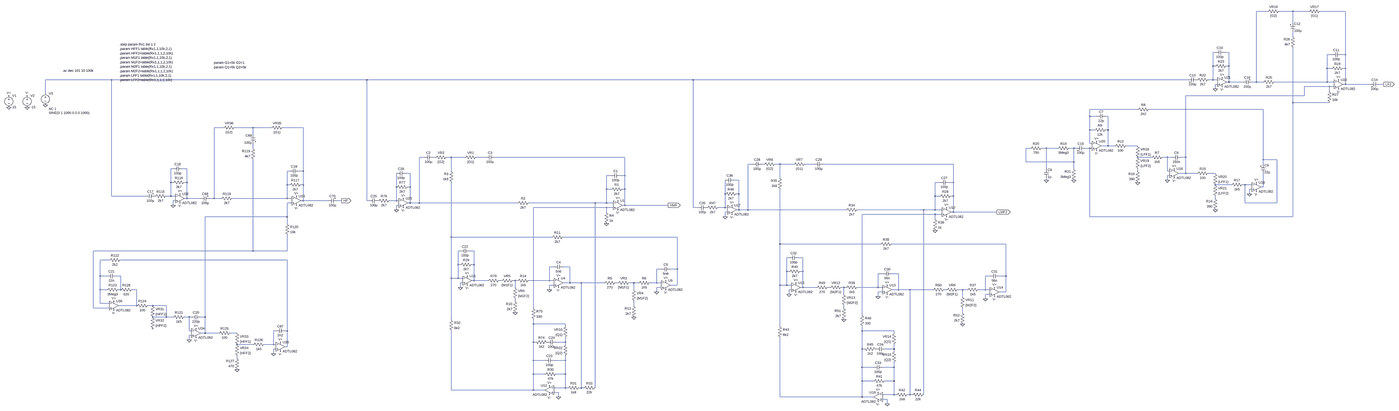
[diagram p0: schematic purrtico_m.asc, whole sheet]
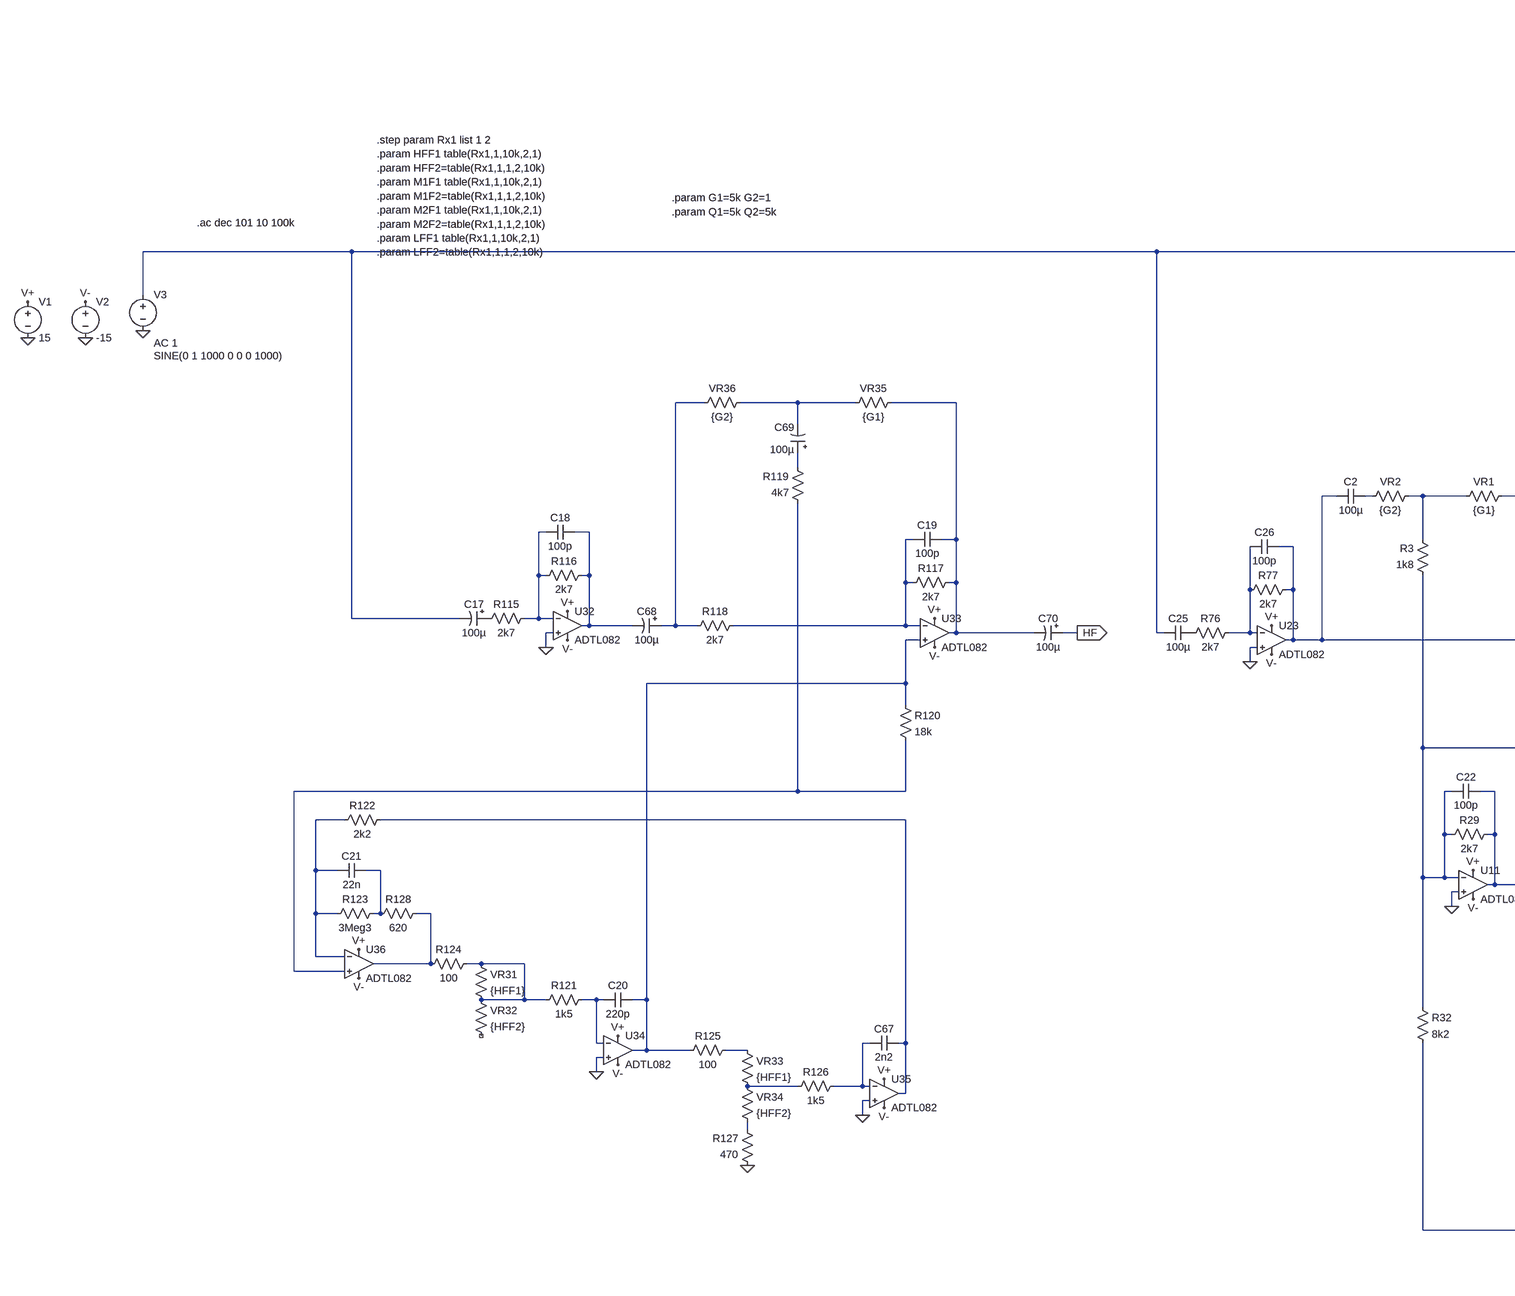
[diagram p1: schematic purrtico_m.asc, part, row 1 of 1, column 1 of 3]
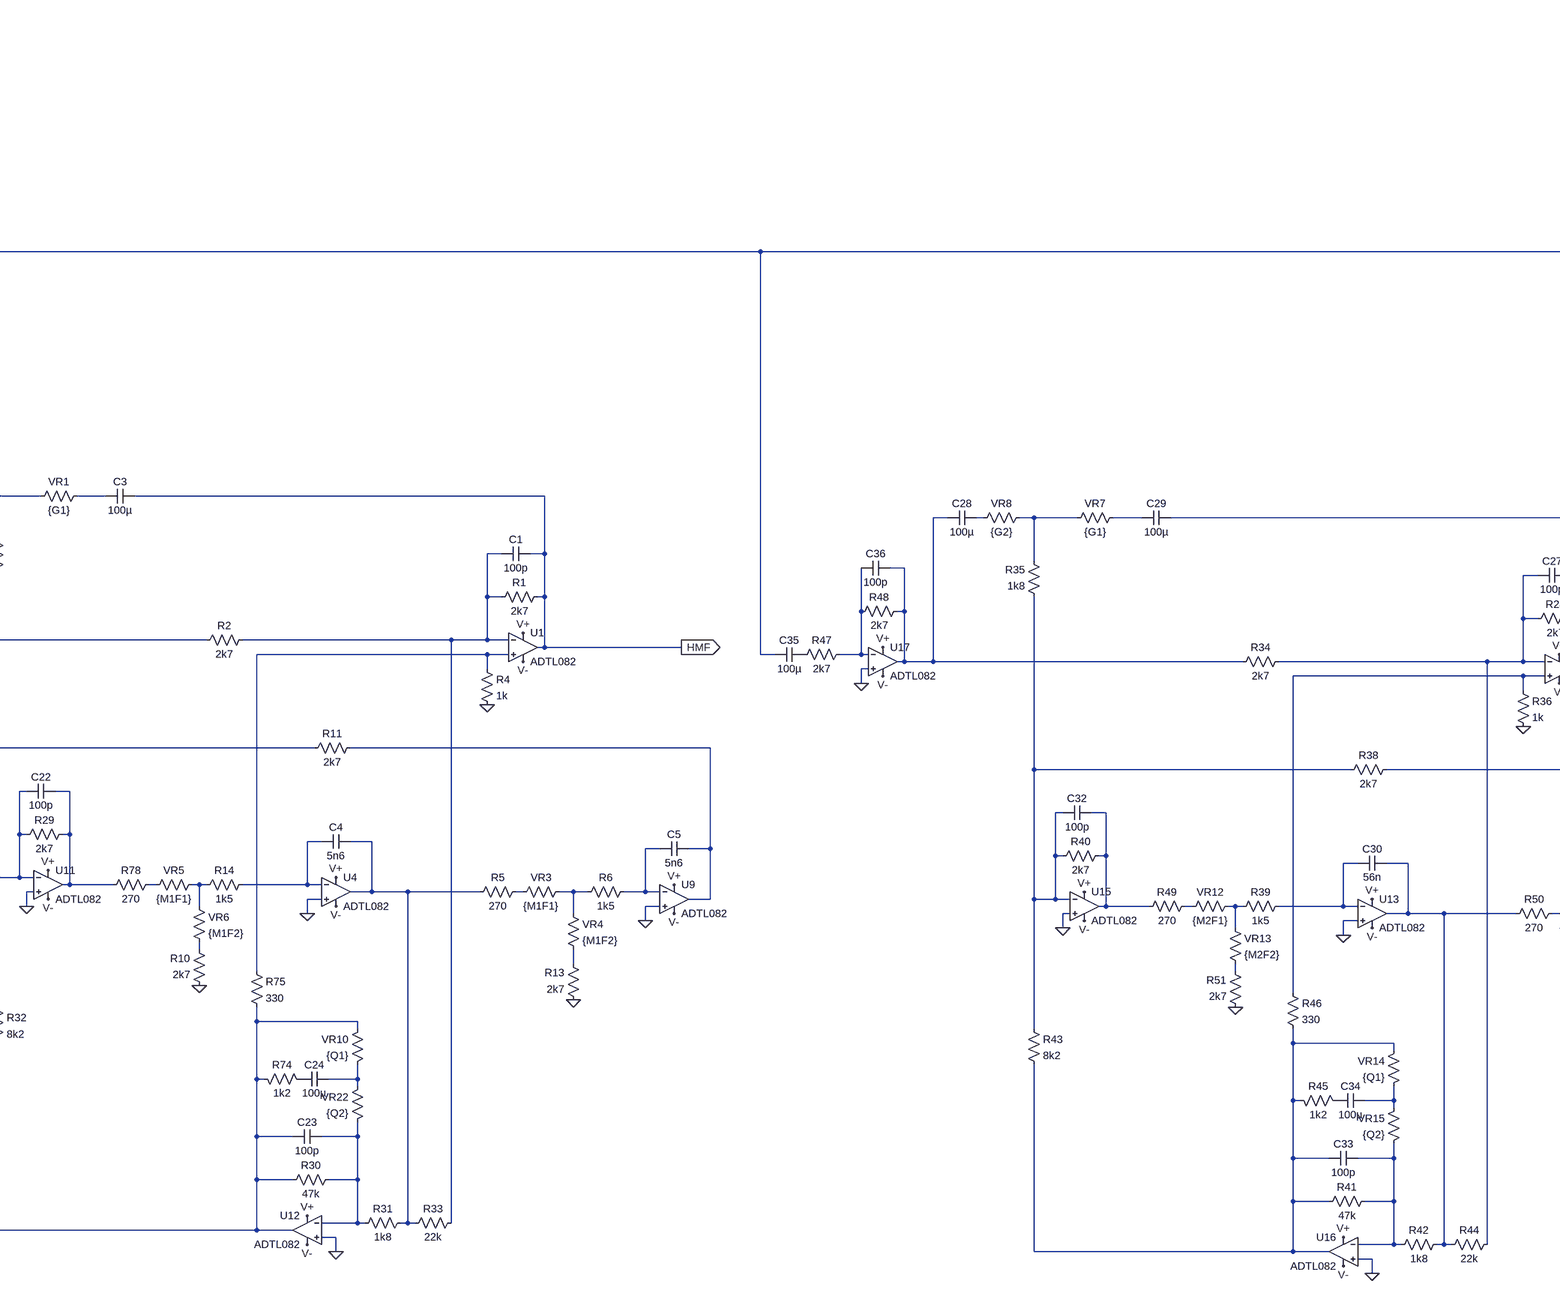
[diagram p2: schematic purrtico_m.asc, part, row 1 of 1, column 2 of 3]
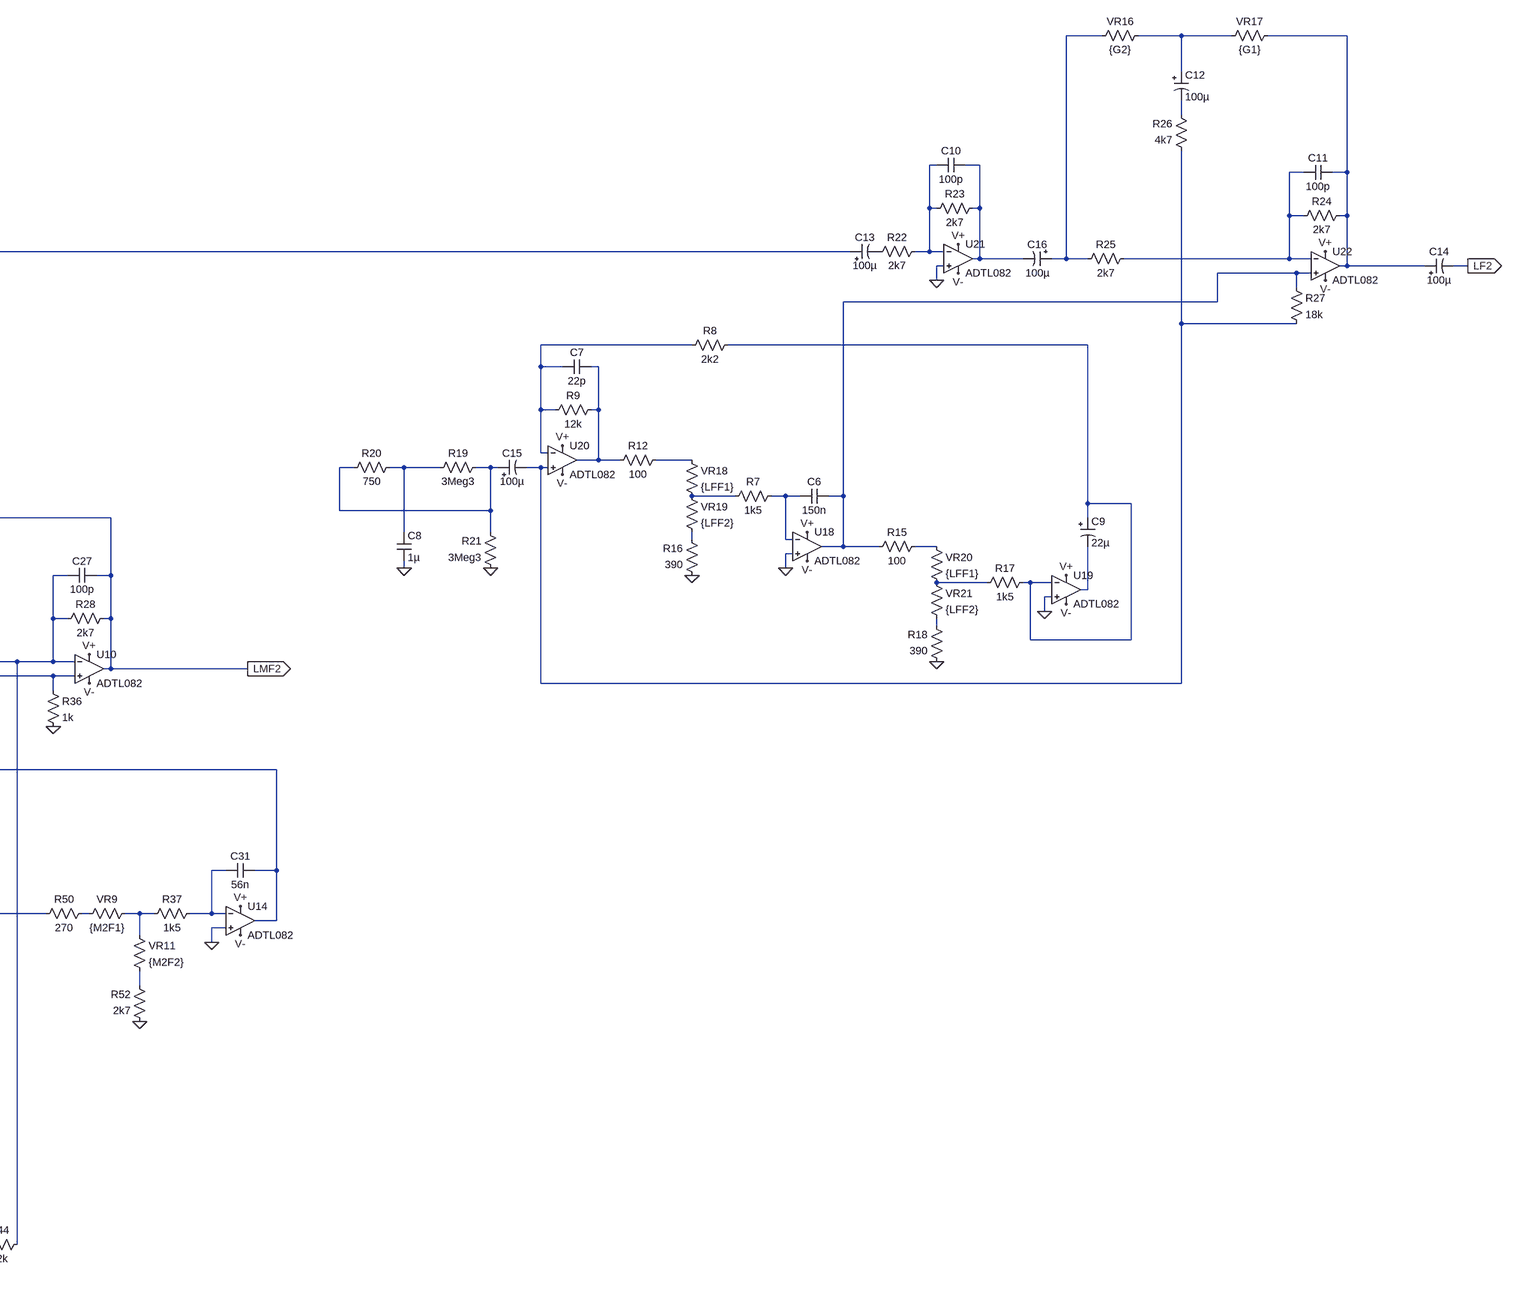
[diagram p3: schematic purrtico_m.asc, part, row 1 of 1, column 3 of 3]
purrtico_m.asc, the LTspice schematic file:
Version 4
SHEET 1 4100 3784
WIRE 960 -736 880 -736
WIRE 1136 -736 1040 -736
WIRE 1248 -736 1136 -736
WIRE 1504 -736 1328 -736
WIRE 1136 -656 1136 -736
WIRE 1136 -560 1136 -592
WIRE 592 -448 576 -448
WIRE 688 -448 656 -448
WIRE 1408 -432 1376 -432
WIRE 1504 -432 1504 -736
WIRE 1504 -432 1472 -432
WIRE 576 -352 576 -448
WIRE 592 -352 576 -352
WIRE 688 -352 688 -448
WIRE 688 -352 672 -352
WIRE 1376 -336 1376 -432
WIRE 1408 -336 1376 -336
WIRE 1504 -336 1504 -432
WIRE 1504 -336 1488 -336
WIRE -7264 -256 -7728 -256
WIRE -5376 -256 -7264 -256
WIRE -3088 -256 -5376 -256
WIRE 400 -256 -3088 -256
WIRE 576 -256 576 -352
WIRE 576 -256 544 -256
WIRE 608 -256 576 -256
WIRE 688 -240 688 -352
WIRE 688 -240 672 -240
WIRE 784 -240 688 -240
WIRE 880 -240 880 -736
WIRE 880 -240 848 -240
WIRE 928 -240 880 -240
WIRE 1376 -240 1376 -336
WIRE 1376 -240 1008 -240
WIRE 1424 -240 1376 -240
WIRE 608 -224 592 -224
WIRE 1504 -224 1504 -336
WIRE 1504 -224 1488 -224
WIRE 1712 -224 1504 -224
WIRE 1808 -224 1776 -224
WIRE 1392 -208 1216 -208
WIRE 1424 -208 1392 -208
WIRE 592 -192 592 -224
WIRE 1392 -176 1392 -208
WIRE -7728 -160 -7728 -256
WIRE 1216 -144 1216 -208
WIRE 1216 -144 384 -144
WIRE 1136 -96 1136 -480
WIRE 1392 -96 1136 -96
WIRE 48 -48 -288 -48
WIRE 928 -48 128 -48
WIRE -288 0 -288 -48
WIRE -240 0 -288 0
WIRE -160 0 -176 0
WIRE -6480 80 -6544 80
WIRE -6272 80 -6400 80
WIRE -6144 80 -6272 80
WIRE -5920 80 -6064 80
WIRE -288 96 -288 0
WIRE -256 96 -288 96
WIRE -160 96 -160 0
WIRE -160 96 -176 96
WIRE -6272 128 -6272 80
WIRE -288 192 -288 96
WIRE -272 192 -288 192
WIRE -160 208 -160 96
WIRE -160 208 -208 208
WIRE -112 208 -160 208
WIRE 48 208 -32 208
WIRE -6272 224 -6272 192
WIRE -704 224 -736 224
WIRE -592 224 -624 224
WIRE -512 224 -592 224
WIRE -400 224 -432 224
WIRE -384 224 -400 224
WIRE -288 224 -320 224
WIRE -272 224 -288 224
WIRE -4976 288 -5008 288
WIRE -4896 288 -4912 288
WIRE -4784 288 -4816 288
WIRE -4688 288 -4784 288
WIRE -4544 288 -4608 288
WIRE -3568 288 -4480 288
WIRE 144 288 48 288
WIRE 256 288 224 288
WIRE 288 288 256 288
WIRE 384 288 384 -144
WIRE 384 288 352 288
WIRE 928 304 928 -48
WIRE 1024 304 928 304
WIRE -736 320 -736 224
WIRE -400 320 -400 224
WIRE -400 320 -736 320
WIRE -2672 336 -2704 336
WIRE -2592 336 -2608 336
WIRE -2480 336 -2512 336
WIRE -2384 336 -2480 336
WIRE -2240 336 -2304 336
WIRE -1264 336 -2176 336
WIRE 928 336 928 304
WIRE -6832 368 -6848 368
WIRE -6736 368 -6768 368
WIRE -592 368 -592 224
WIRE -400 368 -400 320
WIRE -6016 384 -6032 384
WIRE -5920 384 -5920 80
WIRE -5920 384 -5952 384
WIRE -4784 384 -4784 288
WIRE 48 384 48 368
WIRE 256 384 256 288
WIRE 272 384 256 384
WIRE -5072 400 -5104 400
WIRE 384 400 384 288
WIRE 384 400 336 400
WIRE 464 400 384 400
WIRE 592 400 544 400
WIRE -3664 416 -3696 416
WIRE -3568 416 -3568 288
WIRE -3568 416 -3600 416
WIRE 272 416 256 416
WIRE -2480 432 -2480 336
WIRE -2768 448 -2800 448
WIRE -592 448 -592 432
WIRE 256 448 256 416
WIRE -6848 464 -6848 368
WIRE -6832 464 -6848 464
WIRE -6736 464 -6736 368
WIRE -6736 464 -6752 464
WIRE -1360 464 -1392 464
WIRE -1264 464 -1264 336
WIRE -1264 464 -1296 464
WIRE -6032 480 -6032 384
WIRE -6016 480 -6032 480
WIRE -5920 480 -5920 384
WIRE -5920 480 -5936 480
WIRE 704 480 592 480
WIRE 800 480 784 480
WIRE 848 480 800 480
WIRE -5168 496 -5168 400
WIRE -5072 496 -5072 400
WIRE -5072 496 -5088 496
WIRE 928 496 928 400
WIRE 928 496 912 496
WIRE -3696 512 -3696 416
WIRE -3664 512 -3696 512
WIRE -3568 512 -3568 416
WIRE -3568 512 -3584 512
WIRE 848 512 832 512
WIRE -2864 544 -2864 448
WIRE -2768 544 -2768 448
WIRE -2768 544 -2784 544
WIRE 832 544 832 512
WIRE -7264 560 -7264 -256
WIRE -7024 560 -7264 560
WIRE -6848 560 -6848 464
WIRE -6848 560 -6880 560
WIRE -6816 560 -6848 560
WIRE -1392 560 -1392 464
WIRE -1360 560 -1392 560
WIRE -1264 560 -1264 464
WIRE -1264 560 -1280 560
WIRE -6736 576 -6736 464
WIRE -6736 576 -6752 576
WIRE -6640 576 -6736 576
WIRE -6544 576 -6544 80
WIRE -6544 576 -6576 576
WIRE -6496 576 -6544 576
WIRE -6032 576 -6032 480
WIRE -6032 576 -6416 576
WIRE -6000 576 -6032 576
WIRE 592 576 592 560
WIRE -6816 592 -6832 592
WIRE -5920 592 -5920 480
WIRE -5920 592 -5936 592
WIRE -5712 592 -5920 592
WIRE -5616 592 -5648 592
WIRE -5376 592 -5376 -256
WIRE -5360 592 -5376 592
WIRE -5168 592 -5168 496
WIRE -5168 592 -5216 592
WIRE -5152 592 -5168 592
WIRE -6000 608 -6032 608
WIRE -5072 608 -5072 496
WIRE -5072 608 -5088 608
WIRE -5008 608 -5008 288
WIRE -5008 608 -5072 608
WIRE -4320 608 -5008 608
WIRE -3776 608 -4240 608
WIRE -3696 608 -3696 512
WIRE -3696 608 -3776 608
WIRE -3648 608 -3696 608
WIRE 800 608 800 480
WIRE 1024 608 1024 304
WIRE 1024 608 800 608
WIRE -6832 624 -6832 592
WIRE -5152 624 -5168 624
WIRE -3568 624 -3568 512
WIRE -3568 624 -3584 624
WIRE -3264 624 -3568 624
WIRE -3696 640 -4208 640
WIRE -3648 640 -3696 640
WIRE -3088 640 -3088 -256
WIRE -3056 640 -3088 640
WIRE -2864 640 -2864 544
WIRE -2864 640 -2912 640
WIRE -2848 640 -2864 640
WIRE -5168 656 -5168 624
WIRE -2768 656 -2768 544
WIRE -2768 656 -2784 656
WIRE -2704 656 -2704 336
WIRE -2704 656 -2768 656
WIRE -2016 656 -2704 656
WIRE -1472 656 -1936 656
WIRE -1392 656 -1392 560
WIRE -1392 656 -1472 656
WIRE -1344 656 -1392 656
WIRE -3696 672 -3696 640
WIRE -2848 672 -2864 672
WIRE -1264 672 -1264 560
WIRE -1264 672 -1280 672
WIRE -960 672 -1264 672
WIRE -1392 688 -1904 688
WIRE -1344 688 -1392 688
WIRE -6032 704 -6032 608
WIRE -6032 704 -6608 704
WIRE -2864 704 -2864 672
WIRE -288 704 -288 224
WIRE 1136 704 1136 -96
WIRE 1136 704 -288 704
WIRE -1392 720 -1392 688
WIRE -6032 752 -6032 704
WIRE -4784 848 -4784 464
WIRE -4080 848 -4784 848
WIRE -3200 848 -4000 848
WIRE -2480 896 -2480 512
WIRE -1776 896 -2480 896
WIRE -896 896 -1696 896
WIRE -6272 944 -6272 304
WIRE -6272 944 -7392 944
WIRE -6032 944 -6032 832
WIRE -6032 944 -6272 944
WIRE -4720 944 -4736 944
WIRE -4624 944 -4656 944
WIRE -2416 992 -2432 992
WIRE -2320 992 -2352 992
WIRE -7280 1008 -7344 1008
WIRE -6032 1008 -7200 1008
WIRE -4736 1040 -4736 944
WIRE -4720 1040 -4736 1040
WIRE -4624 1040 -4624 944
WIRE -4624 1040 -4640 1040
WIRE -4064 1056 -4096 1056
WIRE -3952 1056 -4000 1056
WIRE -3312 1072 -3344 1072
WIRE -3200 1072 -3200 848
WIRE -3200 1072 -3248 1072
WIRE -2432 1088 -2432 992
WIRE -2416 1088 -2432 1088
WIRE -2320 1088 -2320 992
WIRE -2320 1088 -2336 1088
WIRE -1760 1104 -1792 1104
WIRE -1648 1104 -1696 1104
WIRE -7344 1120 -7344 1008
WIRE -7296 1120 -7344 1120
WIRE -7200 1120 -7232 1120
WIRE -1008 1120 -1040 1120
WIRE -896 1120 -896 896
WIRE -896 1120 -944 1120
WIRE -4784 1136 -4784 848
WIRE -4736 1136 -4736 1040
WIRE -4736 1136 -4784 1136
WIRE -4704 1136 -4736 1136
WIRE -4624 1152 -4624 1040
WIRE -4624 1152 -4640 1152
WIRE -4528 1152 -4624 1152
WIRE -4432 1152 -4448 1152
WIRE -4336 1152 -4352 1152
WIRE -4320 1152 -4336 1152
WIRE -4096 1152 -4096 1056
WIRE -4096 1152 -4240 1152
WIRE -4064 1152 -4096 1152
WIRE -4704 1168 -4720 1168
WIRE -3952 1168 -3952 1056
WIRE -3952 1168 -4000 1168
WIRE -3872 1168 -3952 1168
WIRE -3712 1168 -3872 1168
WIRE -3616 1168 -3632 1168
WIRE -3504 1168 -3536 1168
WIRE -3472 1168 -3504 1168
WIRE -3344 1168 -3344 1072
WIRE -3344 1168 -3392 1168
WIRE -3312 1168 -3344 1168
WIRE -4064 1184 -4096 1184
WIRE -3200 1184 -3200 1072
WIRE -3200 1184 -3248 1184
WIRE -2480 1184 -2480 896
WIRE -2432 1184 -2432 1088
WIRE -2432 1184 -2480 1184
WIRE -2400 1184 -2432 1184
WIRE -4720 1200 -4720 1168
WIRE -4336 1200 -4336 1152
WIRE -3312 1200 -3344 1200
WIRE -2320 1200 -2320 1088
WIRE -2320 1200 -2336 1200
WIRE -2224 1200 -2320 1200
WIRE -2128 1200 -2144 1200
WIRE -2032 1200 -2048 1200
WIRE -2016 1200 -2032 1200
WIRE -1792 1200 -1792 1104
WIRE -1792 1200 -1936 1200
WIRE -1760 1200 -1792 1200
WIRE -7344 1216 -7344 1120
WIRE -7296 1216 -7344 1216
WIRE -7200 1216 -7200 1120
WIRE -7200 1216 -7216 1216
WIRE -7088 1216 -7120 1216
WIRE -4096 1216 -4096 1184
WIRE -3504 1216 -3504 1168
WIRE -2400 1216 -2416 1216
WIRE -1648 1216 -1648 1104
WIRE -1648 1216 -1696 1216
WIRE -1568 1216 -1648 1216
WIRE -1408 1216 -1568 1216
WIRE -1312 1216 -1328 1216
WIRE -1200 1216 -1232 1216
WIRE -1168 1216 -1200 1216
WIRE -1040 1216 -1040 1120
WIRE -1040 1216 -1088 1216
WIRE -1008 1216 -1040 1216
WIRE -3344 1232 -3344 1200
WIRE -1760 1232 -1792 1232
WIRE -896 1232 -896 1120
WIRE -896 1232 -944 1232
WIRE -2416 1248 -2416 1216
WIRE -2032 1248 -2032 1200
WIRE -1008 1248 -1040 1248
WIRE -1792 1264 -1792 1232
WIRE -1200 1264 -1200 1216
WIRE -1040 1280 -1040 1248
WIRE -4336 1296 -4336 1280
WIRE -7344 1312 -7344 1216
WIRE -7280 1312 -7344 1312
WIRE -7088 1328 -7088 1216
WIRE -7088 1328 -7216 1328
WIRE -6976 1328 -7008 1328
WIRE -6880 1328 -6976 1328
WIRE -3504 1328 -3504 1296
WIRE -7392 1344 -7392 944
WIRE -7280 1344 -7392 1344
WIRE -4208 1344 -4208 640
WIRE -2032 1344 -2032 1328
WIRE -1200 1376 -1200 1344
WIRE -1904 1392 -1904 688
WIRE -6880 1408 -6880 1328
WIRE -6880 1408 -6976 1408
WIRE -6832 1408 -6880 1408
WIRE -6720 1408 -6752 1408
WIRE -6704 1408 -6720 1408
WIRE -6608 1408 -6608 704
WIRE -6608 1408 -6640 1408
WIRE -4784 1424 -4784 1136
WIRE -4208 1456 -4208 1424
WIRE -3984 1456 -4208 1456
WIRE -3984 1472 -3984 1456
WIRE -2480 1472 -2480 1184
WIRE -6720 1504 -6720 1408
WIRE -6704 1504 -6720 1504
WIRE -6112 1504 -6128 1504
WIRE -6032 1504 -6032 1008
WIRE -6032 1504 -6048 1504
WIRE -1904 1504 -1904 1472
WIRE -1680 1504 -1904 1504
WIRE -6608 1520 -6608 1408
WIRE -6608 1520 -6640 1520
WIRE -6512 1520 -6608 1520
WIRE -6384 1520 -6432 1520
WIRE -1680 1520 -1680 1504
WIRE -6704 1536 -6720 1536
WIRE -6720 1568 -6720 1536
WIRE -4208 1584 -4208 1456
WIRE -4192 1584 -4208 1584
WIRE -3984 1584 -3984 1552
WIRE -3984 1584 -4048 1584
WIRE -6272 1600 -6384 1600
WIRE -6128 1600 -6128 1504
WIRE -6128 1600 -6192 1600
WIRE -6112 1600 -6128 1600
WIRE -3984 1600 -3984 1584
WIRE -6032 1616 -6032 1504
WIRE -6032 1616 -6048 1616
WIRE -6112 1632 -6128 1632
WIRE -1904 1632 -1904 1504
WIRE -1888 1632 -1904 1632
WIRE -1680 1632 -1680 1600
WIRE -1680 1632 -1744 1632
WIRE -1680 1648 -1680 1632
WIRE -6128 1664 -6128 1632
WIRE -6384 1696 -6384 1680
WIRE -4208 1712 -4208 1584
WIRE -4128 1712 -4208 1712
WIRE -3984 1712 -3984 1680
WIRE -3984 1712 -4064 1712
WIRE -1904 1760 -1904 1632
WIRE -1824 1760 -1904 1760
WIRE -1680 1760 -1680 1728
WIRE -1680 1760 -1760 1760
WIRE -4208 1808 -4208 1712
WIRE -4128 1808 -4208 1808
WIRE -3984 1808 -3984 1712
WIRE -3984 1808 -4048 1808
WIRE -1904 1856 -1904 1760
WIRE -1824 1856 -1904 1856
WIRE -1680 1856 -1680 1760
WIRE -1680 1856 -1744 1856
WIRE -3984 1904 -3984 1808
WIRE -3984 1904 -4064 1904
WIRE -3968 1904 -3984 1904
WIRE -3872 1904 -3872 1168
WIRE -3872 1904 -3888 1904
WIRE -3856 1904 -3872 1904
WIRE -3776 1904 -3776 608
WIRE -4784 1920 -4784 1504
WIRE -4208 1920 -4208 1808
WIRE -4208 1920 -4784 1920
WIRE -4128 1920 -4208 1920
WIRE -4032 1936 -4064 1936
WIRE -1680 1952 -1680 1856
WIRE -1680 1952 -1760 1952
WIRE -1664 1952 -1680 1952
WIRE -1568 1952 -1568 1216
WIRE -1568 1952 -1584 1952
WIRE -1552 1952 -1568 1952
WIRE -1472 1952 -1472 656
WIRE -4032 1968 -4032 1936
WIRE -2480 1968 -2480 1552
WIRE -1904 1968 -1904 1856
WIRE -1904 1968 -2480 1968
WIRE -1824 1968 -1904 1968
WIRE -1728 1984 -1760 1984
WIRE -1728 2016 -1728 1984
FLAG -7984 -64 0
FLAG -7984 -144 V+
FLAG -7856 -64 0
FLAG -7856 -144 V-
FLAG -7728 -80 0
FLAG -5616 592 HF
IOPIN -5616 592 Out
FLAG -6784 544 V+
FLAG -6784 608 V-
FLAG -6832 624 0
FLAG -5968 560 V+
FLAG -5968 624 V-
FLAG -6672 1488 V+
FLAG -6672 1552 V-
FLAG -6720 1568 0
FLAG -6080 1584 V+
FLAG -6080 1648 V-
FLAG -7248 1296 V+
FLAG -7248 1360 V-
FLAG -6128 1664 0
FLAG -6384 1776 0
FLAG 304 368 V+
FLAG 304 432 V-
FLAG 256 448 0
FLAG 880 464 V+
FLAG 880 528 V-
FLAG -240 176 V+
FLAG -240 240 V-
FLAG 832 544 0
FLAG 592 656 0
FLAG -592 448 0
FLAG -400 448 0
FLAG 1808 -224 LF2
IOPIN 1808 -224 Out
FLAG 640 -272 V+
FLAG 640 -208 V-
FLAG 592 -192 0
FLAG 1456 -256 V+
FLAG 1456 -192 V-
FLAG 48 464 0
FLAG -3264 624 HMF
IOPIN -3264 624 Out
FLAG -3616 592 V+
FLAG -3616 656 V-
FLAG -3696 752 0
FLAG -4032 1136 V+
FLAG -4032 1200 V-
FLAG -3280 1152 V+
FLAG -3280 1216 V-
FLAG -3344 1232 0
FLAG -4096 1216 0
FLAG -3504 1408 0
FLAG -4672 1120 V+
FLAG -4672 1184 V-
FLAG -4720 1200 0
FLAG -4336 1376 0
FLAG -4096 1888 V+
FLAG -4096 1952 V-
FLAG -4032 1968 0
FLAG -5120 576 V+
FLAG -5120 640 V-
FLAG -5168 656 0
FLAG -960 672 LMF2
IOPIN -960 672 Out
FLAG -1312 640 V+
FLAG -1312 704 V-
FLAG -1392 800 0
FLAG -1728 1184 V+
FLAG -1728 1248 V-
FLAG -976 1200 V+
FLAG -976 1264 V-
FLAG -1040 1280 0
FLAG -1792 1264 0
FLAG -1200 1456 0
FLAG -2368 1168 V+
FLAG -2368 1232 V-
FLAG -2416 1248 0
FLAG -2032 1424 0
FLAG -1792 1936 V+
FLAG -1792 2000 V-
FLAG -1728 2016 0
FLAG -2816 624 V+
FLAG -2816 688 V-
FLAG -2864 704 0
SYMBOL voltage -7984 -160 R0
WINDOW 123 0 0 Left 0
WINDOW 39 0 0 Left 0
SYMATTR InstName V1
SYMATTR Value 15
SYMBOL voltage -7856 -160 R0
WINDOW 123 0 0 Left 0
WINDOW 39 0 0 Left 0
SYMATTR InstName V2
SYMATTR Value -15
SYMBOL voltage -7728 -176 R0
WINDOW 3 24 152 Left 2
WINDOW 123 24 124 Left 2
WINDOW 39 0 0 Left 0
SYMATTR Value SINE(0 1 1000 0 0 0 1000)
SYMATTR Value2 AC 1
SYMATTR InstName V3
SYMBOL polcap -6960 544 R90
WINDOW 0 0 32 VBottom 2
WINDOW 3 32 32 VTop 2
SYMATTR InstName C17
SYMATTR Value 100µ
SYMATTR Description Capacitor
SYMATTR Type cap
SYMATTR SpiceLine V=35 Irms=414m Rser=0.18 Lser=3.3n mfg="Würth Elektronik" pn="860160574013 WCAP-ATLL 8x11,5" type="Al electrolytic"
SYMBOL res -6864 544 R90
WINDOW 0 0 56 VBottom 2
WINDOW 3 32 56 VTop 2
SYMATTR InstName R115
SYMATTR Value 2k7
SYMBOL Opamps\\ADTL082 -6784 512 R0
SYMATTR InstName U32
SYMBOL res -6736 448 R90
WINDOW 0 0 56 VBottom 2
WINDOW 3 32 56 VTop 2
SYMATTR InstName R116
SYMATTR Value 2k7
SYMBOL cap -6768 352 R90
WINDOW 0 0 32 VBottom 2
WINDOW 3 32 32 VTop 2
SYMATTR InstName C18
SYMATTR Value 100p
SYMBOL Opamps\\ADTL082 -5968 528 R0
SYMATTR InstName U33
SYMBOL res -5920 464 R90
WINDOW 0 0 56 VBottom 2
WINDOW 3 32 56 VTop 2
SYMATTR InstName R117
SYMATTR Value 2k7
SYMBOL cap -5952 368 R90
WINDOW 0 0 32 VBottom 2
WINDOW 3 32 32 VTop 2
SYMATTR InstName C19
SYMATTR Value 100p
SYMBOL res -6400 560 R90
WINDOW 0 0 56 VBottom 2
WINDOW 3 32 56 VTop 2
SYMATTR InstName R118
SYMATTR Value 2k7
SYMBOL res -6256 320 R180
WINDOW 0 36 76 Left 2
WINDOW 3 36 40 Left 2
SYMATTR InstName R119
SYMATTR Value 4k7
SYMBOL res -6048 736 R0
SYMATTR InstName R120
SYMATTR Value 18k
SYMBOL Opamps\\ADTL082 -6672 1456 R0
SYMATTR InstName U34
SYMBOL cap -6640 1392 R90
WINDOW 0 0 32 VBottom 2
WINDOW 3 32 32 VTop 2
SYMATTR InstName C20
SYMATTR Value 220p
SYMBOL res -6736 1392 R90
WINDOW 0 0 56 VBottom 2
WINDOW 3 32 56 VTop 2
SYMATTR InstName R121
SYMATTR Value 1k5
SYMBOL Opamps\\ADTL082 -6080 1552 R0
SYMATTR InstName U35
SYMBOL res -7184 992 R90
WINDOW 0 0 56 VBottom 2
WINDOW 3 32 56 VTop 2
SYMATTR InstName R122
SYMATTR Value 2k2
SYMBOL Opamps\\ADTL082 -7248 1264 R0
SYMATTR InstName U36
SYMBOL res -7200 1200 R90
WINDOW 0 0 56 VBottom 2
WINDOW 3 32 56 VTop 2
SYMATTR InstName R123
SYMATTR Value 3Meg3
SYMBOL cap -7232 1104 R90
WINDOW 0 0 32 VBottom 2
WINDOW 3 32 32 VTop 2
SYMATTR InstName C21
SYMATTR Value 22n
SYMBOL res -6176 1584 R90
WINDOW 0 0 56 VBottom 2
WINDOW 3 32 56 VTop 2
SYMATTR InstName R126
SYMATTR Value 1k5
SYMBOL cap -6048 1488 R90
WINDOW 0 0 32 VBottom 2
WINDOW 3 32 32 VTop 2
SYMATTR InstName C67
SYMATTR Value 2n2
SYMBOL res -7104 1200 R90
WINDOW 0 0 56 VBottom 2
WINDOW 3 32 56 VTop 2
SYMATTR InstName R128
SYMATTR Value 620
SYMBOL polcap -6576 560 R90
WINDOW 0 0 32 VBottom 2
WINDOW 3 32 32 VTop 2
SYMATTR InstName C68
SYMATTR Value 100µ
SYMATTR Description Capacitor
SYMATTR Type cap
SYMATTR SpiceLine V=35 Irms=414m Rser=0.18 Lser=3.3n mfg="Würth Elektronik" pn="860160574013 WCAP-ATLL 8x11,5" type="Al electrolytic"
SYMBOL polcap -6256 192 R180
WINDOW 0 24 57 Left 2
WINDOW 3 24 8 Left 2
SYMATTR InstName C69
SYMATTR Value 100µ
SYMATTR Description Capacitor
SYMATTR Type cap
SYMATTR SpiceLine V=35 Irms=414m Rser=0.18 Lser=3.3n mfg="Würth Elektronik" pn="860160574013 WCAP-ATLL 8x11,5" type="Al electrolytic"
SYMBOL polcap -5648 576 R90
WINDOW 0 0 32 VBottom 2
WINDOW 3 32 32 VTop 2
SYMATTR InstName C70
SYMATTR Value 100µ
SYMATTR Description Capacitor
SYMATTR Type cap
SYMATTR SpiceLine V=35 Irms=414m Rser=0.18 Lser=3.3n mfg="Würth Elektronik" pn="860160574013 WCAP-ATLL 8x11,5" type="Al electrolytic"
SYMBOL res -6992 1312 R90
WINDOW 0 0 56 VBottom 2
WINDOW 3 32 56 VTop 2
SYMATTR InstName R124
SYMATTR Value 100
SYMBOL res -6416 1504 R90
WINDOW 0 0 56 VBottom 2
WINDOW 3 32 56 VTop 2
SYMATTR InstName R125
SYMATTR Value 100
SYMBOL res -6368 1792 R180
WINDOW 0 36 76 Left 2
WINDOW 3 36 40 Left 2
SYMATTR InstName R127
SYMATTR Value 470
SYMBOL res -6992 1312 R0
SYMATTR InstName VR31
SYMATTR Value {HFF1}
SYMBOL res -6992 1392 R0
SYMATTR InstName VR32
SYMATTR Value {HFF2}
SYMBOL res -6400 1504 R0
SYMATTR InstName VR33
SYMATTR Value {HFF1}
SYMBOL res -6400 1584 R0
SYMATTR InstName VR34
SYMATTR Value {HFF2}
SYMBOL res -6048 64 R90
WINDOW 0 0 56 VBottom 2
WINDOW 3 32 56 VTop 2
SYMATTR InstName VR35
SYMATTR Value {G1}
SYMBOL res -6384 64 R90
WINDOW 0 0 56 VBottom 2
WINDOW 3 32 56 VTop 2
SYMATTR InstName VR36
SYMATTR Value {G2}
SYMBOL Opamps\\ADTL082 304 336 R0
SYMATTR InstName U18
SYMBOL cap 352 272 R90
WINDOW 0 0 32 VBottom 2
WINDOW 3 32 32 VTop 2
SYMATTR InstName C6
SYMATTR Value 150n
SYMBOL res 240 272 R90
WINDOW 0 0 56 VBottom 2
WINDOW 3 32 56 VTop 2
SYMATTR InstName R7
SYMATTR Value 1k5
SYMBOL Opamps\\ADTL082 880 432 R0
SYMATTR InstName U19
SYMBOL res 144 -64 R90
WINDOW 0 0 56 VBottom 2
WINDOW 3 32 56 VTop 2
SYMATTR InstName R8
SYMATTR Value 2k2
SYMBOL Opamps\\ADTL082 -240 144 R0
SYMATTR InstName U20
SYMBOL res -160 80 R90
WINDOW 0 0 56 VBottom 2
WINDOW 3 32 56 VTop 2
SYMATTR InstName R9
SYMATTR Value 12k
SYMBOL cap -176 -16 R90
WINDOW 0 0 32 VBottom 2
WINDOW 3 32 32 VTop 2
SYMATTR InstName C7
SYMATTR Value 22p
SYMBOL res 800 464 R90
WINDOW 0 0 56 VBottom 2
WINDOW 3 32 56 VTop 2
SYMATTR InstName R17
SYMATTR Value 1k5
SYMBOL res -416 208 R90
WINDOW 0 0 56 VBottom 2
WINDOW 3 32 56 VTop 2
SYMATTR InstName R19
SYMATTR Value 3Meg3
SYMBOL res -608 208 R90
WINDOW 0 0 56 VBottom 2
WINDOW 3 32 56 VTop 2
SYMATTR InstName R20
SYMATTR Value 750
SYMBOL res -384 464 R180
WINDOW 0 36 76 Left 2
WINDOW 3 36 40 Left 2
SYMATTR InstName R21
SYMATTR Value 3Meg3
SYMBOL cap -608 368 R0
SYMATTR InstName C8
SYMATTR Value 1µ
SYMBOL polcap 912 336 R0
SYMATTR InstName C9
SYMATTR Value 22µ
SYMATTR Description Capacitor
SYMATTR Type cap
SYMATTR SpiceLine V=16 Irms=2.88675 Rser=0.03 Lser=0 mfg="KEMET" pn="A700D226M016ATE030" type="Al electrolytic"
SYMBOL res 560 -272 R90
WINDOW 0 0 56 VBottom 2
WINDOW 3 32 56 VTop 2
SYMATTR InstName R22
SYMATTR Value 2k7
SYMBOL Opamps\\ADTL082 640 -304 R0
SYMATTR InstName U21
SYMBOL res 688 -368 R90
WINDOW 0 0 56 VBottom 2
WINDOW 3 32 56 VTop 2
SYMATTR InstName R23
SYMATTR Value 2k7
SYMBOL cap 656 -464 R90
WINDOW 0 0 32 VBottom 2
WINDOW 3 32 32 VTop 2
SYMATTR InstName C10
SYMATTR Value 100p
SYMBOL Opamps\\ADTL082 1456 -288 R0
SYMATTR InstName U22
SYMBOL res 1504 -352 R90
WINDOW 0 0 56 VBottom 2
WINDOW 3 32 56 VTop 2
SYMATTR InstName R24
SYMATTR Value 2k7
SYMBOL cap 1472 -448 R90
WINDOW 0 0 32 VBottom 2
WINDOW 3 32 32 VTop 2
SYMATTR InstName C11
SYMATTR Value 100p
SYMBOL polcap 1120 -656 R0
SYMATTR InstName C12
SYMATTR Value 100µ
SYMATTR Description Capacitor
SYMATTR Type cap
SYMATTR SpiceLine V=25 Irms=110m Rser=0.5543 Lser=3.868n mfg="Würth Elektronik" pn="865090449009 WCAP-ASLU 8x6,5" type="Al electrolytic"
SYMBOL res 1024 -256 R90
WINDOW 0 0 56 VBottom 2
WINDOW 3 32 56 VTop 2
SYMATTR InstName R25
SYMATTR Value 2k7
SYMBOL res 1152 -464 R180
WINDOW 0 36 76 Left 2
WINDOW 3 36 40 Left 2
SYMATTR InstName R26
SYMATTR Value 4k7
SYMBOL res 1376 -192 R0
SYMATTR InstName R27
SYMATTR Value 18k
SYMBOL polcap 400 -240 R270
WINDOW 0 32 32 VTop 2
WINDOW 3 0 32 VBottom 2
SYMATTR InstName C13
SYMATTR Value 100µ
SYMATTR Description Capacitor
SYMATTR Type cap
SYMATTR SpiceLine V=25 Irms=110m Rser=0.5543 Lser=3.868n mfg="Würth Elektronik" pn="865090449009 WCAP-ASLU 8x6,5" type="Al electrolytic"
SYMBOL polcap 1712 -208 R270
WINDOW 0 32 32 VTop 2
WINDOW 3 0 32 VBottom 2
SYMATTR InstName C14
SYMATTR Value 100µ
SYMATTR Description Capacitor
SYMATTR Type cap
SYMATTR SpiceLine V=25 Irms=110m Rser=0.5543 Lser=3.868n mfg="Würth Elektronik" pn="865090449009 WCAP-ASLU 8x6,5" type="Al electrolytic"
SYMBOL polcap -384 240 R270
WINDOW 0 32 32 VTop 2
WINDOW 3 0 32 VBottom 2
SYMATTR InstName C15
SYMATTR Value 100µ
SYMATTR Description Capacitor
SYMATTR Type cap
SYMATTR SpiceLine V=25 Irms=110m Rser=0.5543 Lser=3.868n mfg="Würth Elektronik" pn="865090449009 WCAP-ASLU 8x6,5" type="Al electrolytic"
SYMBOL polcap 848 -256 R90
WINDOW 0 0 32 VBottom 2
WINDOW 3 32 32 VTop 2
SYMATTR InstName C16
SYMATTR Value 100µ
SYMATTR Description Capacitor
SYMATTR Type cap
SYMATTR SpiceLine V=25 Irms=110m Rser=0.5543 Lser=3.868n mfg="Würth Elektronik" pn="865090449009 WCAP-ASLU 8x6,5" type="Al electrolytic"
SYMBOL res 1056 -752 R90
WINDOW 0 0 56 VBottom 2
WINDOW 3 32 56 VTop 2
SYMATTR InstName VR16
SYMATTR Value {G2}
SYMBOL res 1344 -752 R90
WINDOW 0 0 56 VBottom 2
WINDOW 3 32 56 VTop 2
SYMATTR InstName VR17
SYMATTR Value {G1}
SYMBOL res -16 192 R90
WINDOW 0 0 56 VBottom 2
WINDOW 3 32 56 VTop 2
SYMATTR InstName R12
SYMATTR Value 100
SYMBOL res 560 384 R90
WINDOW 0 0 56 VBottom 2
WINDOW 3 32 56 VTop 2
SYMATTR InstName R15
SYMATTR Value 100
SYMBOL res 32 192 R0
SYMATTR InstName VR18
SYMATTR Value {LFF1}
SYMBOL res 32 272 R0
SYMATTR InstName VR19
SYMATTR Value {LFF2}
SYMBOL res 64 480 R180
WINDOW 0 36 76 Left 2
WINDOW 3 36 40 Left 2
SYMATTR InstName R16
SYMATTR Value 390
SYMBOL res 576 384 R0
SYMATTR InstName VR20
SYMATTR Value {LFF1}
SYMBOL res 576 464 R0
SYMATTR InstName VR21
SYMATTR Value {LFF2}
SYMBOL res 608 672 R180
WINDOW 0 36 76 Left 2
WINDOW 3 36 40 Left 2
SYMATTR InstName R18
SYMATTR Value 390
SYMBOL Opamps\\ADTL082 -3616 560 R0
SYMATTR InstName U1
SYMBOL res -3568 496 R90
WINDOW 0 0 56 VBottom 2
WINDOW 3 32 56 VTop 2
SYMATTR InstName R1
SYMATTR Value 2k7
SYMBOL cap -3600 400 R90
WINDOW 0 0 32 VBottom 2
WINDOW 3 32 32 VTop 2
SYMATTR InstName C1
SYMATTR Value 100p
SYMBOL res -4224 592 R90
WINDOW 0 0 56 VBottom 2
WINDOW 3 32 56 VTop 2
SYMATTR InstName R2
SYMATTR Value 2k7
SYMBOL res -4704 304 R270
WINDOW 0 32 56 VTop 2
WINDOW 3 0 56 VBottom 2
SYMATTR InstName VR1
SYMATTR Value {G1}
SYMBOL res -4800 272 R90
WINDOW 0 0 56 VBottom 2
WINDOW 3 32 56 VTop 2
SYMATTR InstName VR2
SYMATTR Value {G2}
SYMBOL cap -4912 272 R90
WINDOW 0 0 32 VBottom 2
WINDOW 3 32 32 VTop 2
SYMATTR InstName C2
SYMATTR Value 100µ
SYMBOL cap -4480 272 R90
WINDOW 0 0 32 VBottom 2
WINDOW 3 32 32 VTop 2
SYMATTR InstName C3
SYMATTR Value 100µ
SYMBOL res -4768 480 R180
WINDOW 0 36 76 Left 2
WINDOW 3 36 40 Left 2
SYMATTR InstName R3
SYMATTR Value 1k8
SYMBOL res -3712 656 R0
SYMATTR InstName R4
SYMATTR Value 1k
SYMBOL Opamps\\ADTL082 -4032 1104 R0
SYMATTR InstName U4
SYMBOL cap -4000 1040 R90
WINDOW 0 0 32 VBottom 2
WINDOW 3 32 32 VTop 2
SYMATTR InstName C4
SYMATTR Value 5n6
SYMBOL res -3376 1152 R90
WINDOW 0 0 56 VBottom 2
WINDOW 3 32 56 VTop 2
SYMATTR InstName R6
SYMATTR Value 1k5
SYMBOL Opamps\\ADTL082 -3280 1120 R0
SYMATTR InstName U9
SYMBOL cap -3248 1056 R90
WINDOW 0 0 32 VBottom 2
WINDOW 3 32 32 VTop 2
SYMATTR InstName C5
SYMATTR Value 5n6
SYMBOL res -3984 832 R90
WINDOW 0 0 56 VBottom 2
WINDOW 3 32 56 VTop 2
SYMATTR InstName R11
SYMATTR Value 2k7
SYMBOL res -3520 1152 R90
WINDOW 0 0 56 VBottom 2
WINDOW 3 32 56 VTop 2
SYMATTR InstName VR3
SYMATTR Value {M1F1}
SYMBOL res -3520 1200 R0
SYMATTR InstName VR4
SYMATTR Value {M1F2}
SYMBOL res -4224 1136 R90
WINDOW 0 0 56 VBottom 2
WINDOW 3 32 56 VTop 2
SYMATTR InstName R14
SYMATTR Value 1k5
SYMBOL res -4336 1136 R90
WINDOW 0 0 56 VBottom 2
WINDOW 3 32 56 VTop 2
SYMATTR InstName VR5
SYMATTR Value {M1F1}
SYMBOL res -4352 1184 R0
SYMATTR InstName VR6
SYMATTR Value {M1F2}
SYMBOL Opamps\\ADTL082 -4672 1088 R0
SYMATTR InstName U11
SYMBOL res -4624 1024 R90
WINDOW 0 0 56 VBottom 2
WINDOW 3 32 56 VTop 2
SYMATTR InstName R29
SYMATTR Value 2k7
SYMBOL cap -4656 928 R90
WINDOW 0 0 32 VBottom 2
WINDOW 3 32 32 VTop 2
SYMATTR InstName C22
SYMATTR Value 100p
SYMBOL Opamps\\ADTL082 -4096 1856 M0
SYMATTR InstName U12
SYMBOL res -4032 1792 R90
WINDOW 0 0 56 VBottom 2
WINDOW 3 32 56 VTop 2
SYMATTR InstName R30
SYMATTR Value 47k
SYMBOL cap -4064 1696 R90
WINDOW 0 0 32 VBottom 2
WINDOW 3 32 32 VTop 2
SYMATTR InstName C23
SYMATTR Value 100p
SYMBOL res -3872 1888 R90
WINDOW 0 0 56 VBottom 2
WINDOW 3 32 56 VTop 2
SYMATTR InstName R31
SYMATTR Value 1k8
SYMBOL res -4800 1408 R0
SYMATTR InstName R32
SYMATTR Value 8k2
SYMBOL res -3760 1888 R90
WINDOW 0 0 56 VBottom 2
WINDOW 3 32 56 VTop 2
SYMATTR InstName R33
SYMATTR Value 22k
SYMBOL res -3968 1456 M0
SYMATTR InstName VR10
SYMATTR Value {Q1}
SYMBOL res -3968 1584 M0
SYMATTR InstName VR22
SYMATTR Value {Q2}
SYMBOL cap -4112 1568 M90
WINDOW 0 0 32 VBottom 2
WINDOW 3 32 32 VTop 2
SYMATTR InstName C24
SYMATTR Value 100µ
SYMBOL res -4208 1568 M90
WINDOW 0 0 56 VBottom 2
WINDOW 3 32 56 VTop 2
SYMATTR InstName R74
SYMATTR Value 1k2
SYMBOL res -4224 1328 R0
SYMATTR InstName R75
SYMATTR Value 330
SYMBOL cap -5296 576 R90
WINDOW 0 0 32 VBottom 2
WINDOW 3 32 32 VTop 2
SYMATTR InstName C25
SYMATTR Value 100µ
SYMBOL res -5200 576 R90
WINDOW 0 0 56 VBottom 2
WINDOW 3 32 56 VTop 2
SYMATTR InstName R76
SYMATTR Value 2k7
SYMBOL Opamps\\ADTL082 -5120 544 R0
SYMATTR InstName U23
SYMBOL res -5072 480 R90
WINDOW 0 0 56 VBottom 2
WINDOW 3 32 56 VTop 2
SYMATTR InstName R77
SYMATTR Value 2k7
SYMBOL cap -5104 384 R90
WINDOW 0 0 32 VBottom 2
WINDOW 3 32 32 VTop 2
SYMATTR InstName C26
SYMATTR Value 100p
SYMBOL res -4432 1136 R90
WINDOW 0 0 56 VBottom 2
WINDOW 3 32 56 VTop 2
SYMATTR InstName R78
SYMATTR Value 270
SYMBOL res -3616 1152 R90
WINDOW 0 0 56 VBottom 2
WINDOW 3 32 56 VTop 2
SYMATTR InstName R5
SYMATTR Value 270
SYMBOL res -4320 1392 R180
WINDOW 0 36 76 Left 2
WINDOW 3 36 40 Left 2
SYMATTR InstName R10
SYMATTR Value 2k7
SYMBOL res -3488 1424 R180
WINDOW 0 36 76 Left 2
WINDOW 3 36 40 Left 2
SYMATTR InstName R13
SYMATTR Value 2k7
SYMBOL Opamps\\ADTL082 -1312 608 R0
SYMATTR InstName U10
SYMBOL res -1264 544 R90
WINDOW 0 0 56 VBottom 2
WINDOW 3 32 56 VTop 2
SYMATTR InstName R28
SYMATTR Value 2k7
SYMBOL cap -1296 448 R90
WINDOW 0 0 32 VBottom 2
WINDOW 3 32 32 VTop 2
SYMATTR InstName C27
SYMATTR Value 100p
SYMBOL res -1920 640 R90
WINDOW 0 0 56 VBottom 2
WINDOW 3 32 56 VTop 2
SYMATTR InstName R34
SYMATTR Value 2k7
SYMBOL res -2400 352 R270
WINDOW 0 32 56 VTop 2
WINDOW 3 0 56 VBottom 2
SYMATTR InstName VR7
SYMATTR Value {G1}
SYMBOL res -2496 320 R90
WINDOW 0 0 56 VBottom 2
WINDOW 3 32 56 VTop 2
SYMATTR InstName VR8
SYMATTR Value {G2}
SYMBOL cap -2608 320 R90
WINDOW 0 0 32 VBottom 2
WINDOW 3 32 32 VTop 2
SYMATTR InstName C28
SYMATTR Value 100µ
SYMBOL cap -2176 320 R90
WINDOW 0 0 32 VBottom 2
WINDOW 3 32 32 VTop 2
SYMATTR InstName C29
SYMATTR Value 100µ
SYMBOL res -2464 528 R180
WINDOW 0 36 76 Left 2
WINDOW 3 36 40 Left 2
SYMATTR InstName R35
SYMATTR Value 1k8
SYMBOL res -1408 704 R0
SYMATTR InstName R36
SYMATTR Value 1k
SYMBOL Opamps\\ADTL082 -1728 1152 R0
SYMATTR InstName U13
SYMBOL cap -1696 1088 R90
WINDOW 0 0 32 VBottom 2
WINDOW 3 32 32 VTop 2
SYMATTR InstName C30
SYMATTR Value 56n
SYMBOL res -1072 1200 R90
WINDOW 0 0 56 VBottom 2
WINDOW 3 32 56 VTop 2
SYMATTR InstName R37
SYMATTR Value 1k5
SYMBOL Opamps\\ADTL082 -976 1168 R0
SYMATTR InstName U14
SYMBOL cap -944 1104 R90
WINDOW 0 0 32 VBottom 2
WINDOW 3 32 32 VTop 2
SYMATTR InstName C31
SYMATTR Value 56n
SYMBOL res -1680 880 R90
WINDOW 0 0 56 VBottom 2
WINDOW 3 32 56 VTop 2
SYMATTR InstName R38
SYMATTR Value 2k7
SYMBOL res -1216 1200 R90
WINDOW 0 0 56 VBottom 2
WINDOW 3 32 56 VTop 2
SYMATTR InstName VR9
SYMATTR Value {M2F1}
SYMBOL res -1216 1248 R0
SYMATTR InstName VR11
SYMATTR Value {M2F2}
SYMBOL res -1920 1184 R90
WINDOW 0 0 56 VBottom 2
WINDOW 3 32 56 VTop 2
SYMATTR InstName R39
SYMATTR Value 1k5
SYMBOL res -2032 1184 R90
WINDOW 0 0 56 VBottom 2
WINDOW 3 32 56 VTop 2
SYMATTR InstName VR12
SYMATTR Value {M2F1}
SYMBOL res -2048 1232 R0
SYMATTR InstName VR13
SYMATTR Value {M2F2}
SYMBOL Opamps\\ADTL082 -2368 1136 R0
SYMATTR InstName U15
SYMBOL res -2320 1072 R90
WINDOW 0 0 56 VBottom 2
WINDOW 3 32 56 VTop 2
SYMATTR InstName R40
SYMATTR Value 2k7
SYMBOL cap -2352 976 R90
WINDOW 0 0 32 VBottom 2
WINDOW 3 32 32 VTop 2
SYMATTR InstName C32
SYMATTR Value 100p
SYMBOL Opamps\\ADTL082 -1792 1904 M0
SYMATTR InstName U16
SYMBOL res -1728 1840 R90
WINDOW 0 0 56 VBottom 2
WINDOW 3 32 56 VTop 2
SYMATTR InstName R41
SYMATTR Value 47k
SYMBOL cap -1760 1744 R90
WINDOW 0 0 32 VBottom 2
WINDOW 3 32 32 VTop 2
SYMATTR InstName C33
SYMATTR Value 100p
SYMBOL res -1568 1936 R90
WINDOW 0 0 56 VBottom 2
WINDOW 3 32 56 VTop 2
SYMATTR InstName R42
SYMATTR Value 1k8
SYMBOL res -2496 1456 R0
SYMATTR InstName R43
SYMATTR Value 8k2
SYMBOL res -1456 1936 R90
WINDOW 0 0 56 VBottom 2
WINDOW 3 32 56 VTop 2
SYMATTR InstName R44
SYMATTR Value 22k
SYMBOL res -1664 1504 M0
SYMATTR InstName VR14
SYMATTR Value {Q1}
SYMBOL res -1664 1632 M0
SYMATTR InstName VR15
SYMATTR Value {Q2}
SYMBOL cap -1808 1616 M90
WINDOW 0 0 32 VBottom 2
WINDOW 3 32 32 VTop 2
SYMATTR InstName C34
SYMATTR Value 100µ
SYMBOL res -1904 1616 M90
WINDOW 0 0 56 VBottom 2
WINDOW 3 32 56 VTop 2
SYMATTR InstName R45
SYMATTR Value 1k2
SYMBOL res -1920 1376 R0
SYMATTR InstName R46
SYMATTR Value 330
SYMBOL cap -2992 624 R90
WINDOW 0 0 32 VBottom 2
WINDOW 3 32 32 VTop 2
SYMATTR InstName C35
SYMATTR Value 100µ
SYMBOL res -2896 624 R90
WINDOW 0 0 56 VBottom 2
WINDOW 3 32 56 VTop 2
SYMATTR InstName R47
SYMATTR Value 2k7
SYMBOL Opamps\\ADTL082 -2816 592 R0
SYMATTR InstName U17
SYMBOL res -2768 528 R90
WINDOW 0 0 56 VBottom 2
WINDOW 3 32 56 VTop 2
SYMATTR InstName R48
SYMATTR Value 2k7
SYMBOL cap -2800 432 R90
WINDOW 0 0 32 VBottom 2
WINDOW 3 32 32 VTop 2
SYMATTR InstName C36
SYMATTR Value 100p
SYMBOL res -2128 1184 R90
WINDOW 0 0 56 VBottom 2
WINDOW 3 32 56 VTop 2
SYMATTR InstName R49
SYMATTR Value 270
SYMBOL res -1312 1200 R90
WINDOW 0 0 56 VBottom 2
WINDOW 3 32 56 VTop 2
SYMATTR InstName R50
SYMATTR Value 270
SYMBOL res -2016 1440 R180
WINDOW 0 36 76 Left 2
WINDOW 3 36 40 Left 2
SYMATTR InstName R51
SYMATTR Value 2k7
SYMBOL res -1184 1472 R180
WINDOW 0 36 76 Left 2
WINDOW 3 36 40 Left 2
SYMATTR InstName R52
SYMATTR Value 2k7
TEXT -6552 -376 Left 2 !.param G1=5k G2=1
TEXT -7608 -320 Left 2 !.ac dec 101 10 100k
TEXT -7208 -504 Left 2 !.step param Rx1 list 1 2\n.param HFF1 table(Rx1,1,10k,2,1)\n.param HFF2=table(Rx1,1,1,2,10k)\n.param M1F1 table(Rx1,1,10k,2,1)\n.param M1F2=table(Rx1,1,1,2,10k)\n.param M2F1 table(Rx1,1,10k,2,1)\n.param M2F2=table(Rx1,1,1,2,10k)\n.param LFF1 table(Rx1,1,10k,2,1)\n.param LFF2=table(Rx1,1,1,2,10k)
TEXT -6552 -344 Left 2 !.param Q1=5k Q2=5k

The netlist it stands for:
* purrtico_m.asc
V1 V+ 0 15
V2 V- 0 -15
V3 N008 0 SINE(0 1 1000 0 0 0 1000) AC 1
C17 P001 N008 100µ V=35 Irms=414m Rser=0.18 Lser=3.3n mfg="Würth Elektronik" pn="860160574013 WCAP-ATLL 8x11,5" type="Al electrolytic"
R115 N031 P001 2k7
XU32 0 N031 V+ V- N032 ADTL082  ; pins In+ In- V+ V- OUT
R116 N032 N031 2k7
C18 N032 N031 100p
XU33 N043 N033 V+ V- N016 ADTL082  ; pins In+ In- V+ V- OUT
R117 N016 N033 2k7
C19 N016 N033 100p
R118 N033 N014 2k7
R119 N050 N018 4k7
R120 N043 N050 18k
XU34 0 N076 V+ V- N043 ADTL082  ; pins In+ In- V+ V- OUT
C20 N043 N076 220p
R121 N076 N072 1k5
XU35 0 N078 V+ V- N054 ADTL082  ; pins In+ In- V+ V- OUT
R122 N054 N053 2k2
XU36 N050 N053 V+ V- N068 ADTL082  ; pins In+ In- V+ V- OUT
R123 N060 N053 3Meg3
C21 N060 N053 22n
R126 N078 N082 1k5
C67 N054 N078 2n2
R128 N068 N060 620
C68 N014 N032 100µ V=35 Irms=414m Rser=0.18 Lser=3.3n mfg="Würth Elektronik" pn="860160574013 WCAP-ATLL 8x11,5" type="Al electrolytic"
C69 N018 N015 100µ V=35 Irms=414m Rser=0.18 Lser=3.3n mfg="Würth Elektronik" pn="860160574013 WCAP-ATLL 8x11,5" type="Al electrolytic"
C70 HF N016 100µ V=35 Irms=414m Rser=0.18 Lser=3.3n mfg="Würth Elektronik" pn="860160574013 WCAP-ATLL 8x11,5" type="Al electrolytic"
R124 N072 N068 100
R125 N080 N043 100
R127 0 N084 470
R§VR31 N072 N072 {HFF1}
R§VR32 N072 NC_01 {HFF2}
R§VR33 N080 N082 {HFF1}
R§VR34 N082 N084 {HFF2}
R§VR35 N016 N015 {G1}
R§VR36 N015 N014 {G2}
XU18 0 N026 V+ V- N009 ADTL082  ; pins In+ In- V+ V- OUT
C6 N009 N026 150n
R7 N026 N025 1k5
XU19 0 N012 V+ V- N040 ADTL082  ; pins In+ In- V+ V- OUT
R8 N012 N011 2k2
XU20 N010 N011 V+ V- N013 ADTL082  ; pins In+ In- V+ V- OUT
R9 N013 N011 12k
C7 N013 N011 22p
R17 N012 N038 1k5
R19 N019 N020 3Meg3
R20 N020 N019 750
R21 0 N019 3Meg3
C8 N020 0 1µ
C9 N012 N040 22µ V=16 Irms=2.88675 Rser=0.03 Lser=0 mfg="KEMET" pn="A700D226M016ATE030" type="Al electrolytic"
R22 N005 P002 2k7
XU21 0 N005 V+ V- N006 ADTL082  ; pins In+ In- V+ V- OUT
R23 N006 N005 2k7
C10 N006 N005 100p
XU22 N009 N007 V+ V- N003 ADTL082  ; pins In+ In- V+ V- OUT
R24 N003 N007 2k7
C11 N003 N007 100p
C12 N002 N004 100µ V=25 Irms=110m Rser=0.5543 Lser=3.868n mfg="Würth Elektronik" pn="865090449009 WCAP-ASLU 8x6,5" type="Al electrolytic"
R25 N007 N001 2k7
R26 N010 N004 4k7
R27 N009 N010 18k
C13 N008 P002 100µ V=25 Irms=110m Rser=0.5543 Lser=3.868n mfg="Würth Elektronik" pn="865090449009 WCAP-ASLU 8x6,5" type="Al electrolytic"
C14 N003 LF2 100µ V=25 Irms=110m Rser=0.5543 Lser=3.868n mfg="Würth Elektronik" pn="865090449009 WCAP-ASLU 8x6,5" type="Al electrolytic"
C15 N019 N010 100µ V=25 Irms=110m Rser=0.5543 Lser=3.868n mfg="Würth Elektronik" pn="865090449009 WCAP-ASLU 8x6,5" type="Al electrolytic"
C16 N001 N006 100µ V=25 Irms=110m Rser=0.5543 Lser=3.868n mfg="Würth Elektronik" pn="865090449009 WCAP-ASLU 8x6,5" type="Al electrolytic"
R§VR16 N002 N001 {G2}
R§VR17 N003 N002 {G1}
R12 N017 N013 100
R15 N035 N009 100
R§VR18 N017 N025 {LFF1}
R§VR19 N025 N034 {LFF2}
R16 0 N034 390
R§VR20 N035 N038 {LFF1}
R§VR21 N038 N042 {LFF2}
R18 0 N042 390
XU1 N044 N036 V+ V- HMF ADTL082  ; pins In+ In- V+ V- OUT
R1 HMF N036 2k7
C1 HMF N036 100p
R2 N036 N021 2k7
R§VR1 N023 N024 {G1}
R§VR2 N023 N022 {G2}
C2 N022 N021 100µ
C3 HMF N024 100µ
R3 N046 N023 1k8
R4 N044 0 1k
XU4 0 N055 V+ V- N056 ADTL082  ; pins In+ In- V+ V- OUT
C4 N056 N055 5n6
R6 N057 N065 1k5
XU9 0 N057 V+ V- N047 ADTL082  ; pins In+ In- V+ V- OUT
C5 N047 N057 5n6
R11 N047 N046 2k7
R§VR3 N065 N064 {M1F1}
R§VR4 N065 N073 {M1F2}
R14 N055 N063 1k5
R§VR5 N063 N062 {M1F1}
R§VR6 N063 N071 {M1F2}
XU11 0 N046 V+ V- N051 ADTL082  ; pins In+ In- V+ V- OUT
R29 N051 N046 2k7
C22 N051 N046 100p
XU12 0 N085 V+ V- N077 ADTL082  ; pins In+ In- V+ V- OUT
R30 N085 N077 47k
C23 N085 N077 100p
R31 N056 N085 1k8
R32 N046 N077 8k2
R33 N036 N056 22k
R§VR10 N077 N081 {Q1}
R§VR22 N081 N085 {Q2}
C24 P003 N081 100µ
R74 N077 P003 1k2
R75 N044 N077 330
C25 P004 N008 100µ
R76 N039 P004 2k7
XU23 0 N039 V+ V- N021 ADTL082  ; pins In+ In- V+ V- OUT
R77 N021 N039 2k7
C26 N021 N039 100p
R78 N062 N051 270
R5 N064 N056 270
R10 0 N071 2k7
R13 0 N073 2k7
XU10 N045 N037 V+ V- LMF2 ADTL082  ; pins In+ In- V+ V- OUT
R28 LMF2 N037 2k7
C27 LMF2 N037 100p
R34 N037 N027 2k7
R§VR7 N029 N030 {G1}
R§VR8 N029 N028 {G2}
C28 N028 N027 100µ
C29 LMF2 N030 100µ
R35 N048 N029 1k8
R36 N045 0 1k
XU13 0 N058 V+ V- N059 ADTL082  ; pins In+ In- V+ V- OUT
C30 N059 N058 56n
R37 N061 N070 1k5
XU14 0 N061 V+ V- N049 ADTL082  ; pins In+ In- V+ V- OUT
C31 N049 N061 56n
R38 N049 N048 2k7
R§VR9 N070 N069 {M2F1}
R§VR11 N070 N075 {M2F2}
R39 N058 N067 1k5
R§VR12 N067 N066 {M2F1}
R§VR13 N067 N074 {M2F2}
XU15 0 N048 V+ V- N052 ADTL082  ; pins In+ In- V+ V- OUT
R40 N052 N048 2k7
C32 N052 N048 100p
XU16 0 N086 V+ V- N079 ADTL082  ; pins In+ In- V+ V- OUT
R41 N086 N079 47k
C33 N086 N079 100p
R42 N059 N086 1k8
R43 N048 N079 8k2
R44 N037 N059 22k
R§VR14 N079 N083 {Q1}
R§VR15 N083 N086 {Q2}
C34 P005 N083 100µ
R45 N079 P005 1k2
R46 N045 N079 330
C35 P006 N008 100µ
R47 N041 P006 2k7
XU17 0 N041 V+ V- N027 ADTL082  ; pins In+ In- V+ V- OUT
R48 N027 N041 2k7
C36 N027 N041 100p
R49 N066 N052 270
R50 N069 N059 270
R51 0 N074 2k7
R52 0 N075 2k7
.param G1=5k G2=1
.ac dec 101 10 100k
.step param Rx1 list 1 2
.param HFF1 table(Rx1,1,10k,2,1)
.param HFF2=table(Rx1,1,1,2,10k)
.param M1F1 table(Rx1,1,10k,2,1)
.param M1F2=table(Rx1,1,1,2,10k)
.param M2F1 table(Rx1,1,10k,2,1)
.param M2F2=table(Rx1,1,1,2,10k)
.param LFF1 table(Rx1,1,10k,2,1)
.param LFF2=table(Rx1,1,1,2,10k)
.param Q1=5k Q2=5k
.lib ADI.lib
.backanno
.end